# Altium schematic sheet power.SchDoc
size A3
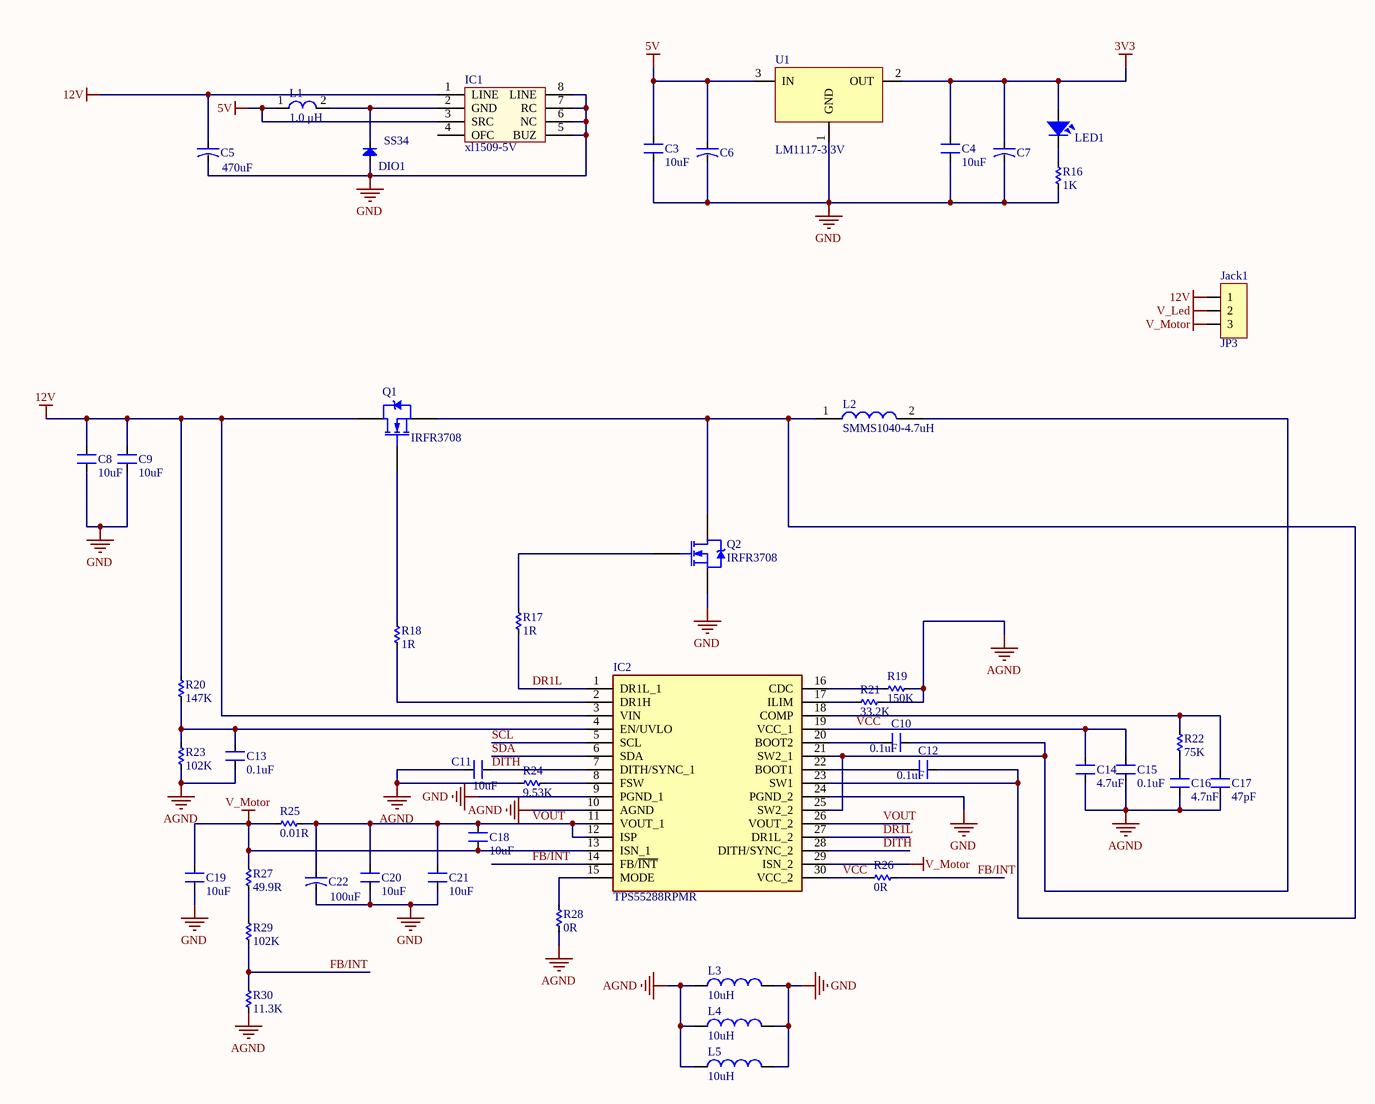
[diagram p0: power.SchDoc]

## Parts
C3  10uF  [CN-SMD-0603]
C4  10uF  [CN-SMD-0603]
C5  470uF  [CAP-ALU-SMD-6.3x7.7x2.2]
C6  CN-ALU-SMD  [CAP-ALU-SMD-4.5x5x1.4]  (value not drawn)
C7  CN-ALU-SMD  [CAP-ALU-SMD-4.5x5x1.4]  (value not drawn)
C8  10uF  [CN-SMD-1206]
C9  10uF  [CN-SMD-1206]
C10  0.1uF  [CN-SMD-0603]
C11  10uF  [CN-SMD-0603]
C12  0.1uF  [CN-SMD-0603]
C13  0.1uF  [CN-SMD-0603]
C14  4.7uF  [CN-SMD-0603]
C15  0.1uF  [CN-SMD-0603]
C16  4.7nF  [CN-SMD-0603]
C17  47pF  [CN-SMD-0603]
C18  10uF  [CN-SMD-0603]
C19  10uF  [CN-SMD-0603]
C20  10uF  [CN-SMD-0603]
C21  10uF  [CN-SMD-0603]
C22  100uF  [CAP-ALU-SMD-6.3x7.7x2.2]
DIO1  SS34  [DIO-SMD-106]
IC1  xl1509-5V  [SO-8]
IC2  TPS55288RPMR  [TPS55288RPMR]
Jack1  JP3  [JP3-D1T]
L1  1.0 μH  [L-SMD-M-7.3x4.5]
L2  SMMS1040-4.7uH  [INDPM115100X400N]
L3  10uH  [INDC1608X95N]
L4  10uH  [INDC1608X95N]
L5  10uH  [INDC1608X95N]
LED1  LED  [LED-0805-Blue]  (value not drawn)
Q1  IRFR3708  [TO-252AA_N]
Q2  IRFR3708  [TO-252AA_N]
R16  1K  [RES-SMD-0603]
R17  1R  [RES-SMD-0603]
R18  1R  [RES-SMD-0603]
R19  150K  [RES-SMD-0603]
R20  147K  [RES-SMD-0603]
R21  33.2K  [RES-SMD-0603]
R22  75K  [RES-SMD-0603]
R23  102K  [RES-SMD-0603]
R24  9.53K  [RES-SMD-0603]
R25  0.01R  [RES-SMD-1206]
R26  0R  [RES-SMD-0603]
R27  49.9R  [RES-SMD-0603]
R28  0R  [RES-SMD-0603]
R29  102K  [RES-SMD-0603]
R30  11.3K  [RES-SMD-0603]
U1  LM1117-3.3V  [SOT223]

## Nets
3V3: C4.1 C7.1 LED1.1 U1.2(OUT)
5V: C3.1 C6.1 IC1.3(SRC) L1.1 U1.3(IN)
12V: C5.1 C8.2 C9.2 IC1.1(LINE) IC2.3(VIN) Jack1.1 Q1.4(D) R20.1
AGND: C11.2 C13.1 C14.1 C15.1 C16.2 C17.2 IC2.10(AGND) L3.1 L4.1 L5.1 R19.2 R21.2 R23.2 R24.1 R28.2 R30.2
GND: C3.2 C4.2 C5.2 C6.2 C7.2 C8.1 C9.1 C19.1 C20.1 C21.1 C22.2 DIO1.1(A) IC1.5(BUZ) IC1.6(NC) IC1.7(RC) IC1.8(LINE) IC2.9(PGND_1) IC2.24(PGND_2) L3.2 L4.2 L5.2 Q2.3(S) R16.2 U1.1(GND)
V_Led: Jack1.2
V_Motor: C18.1 C19.2 IC2.13(ISN_1) IC2.29(ISN_2) Jack1.3 R25.2 R27.1
DITH: C11.1 IC2.7(DITH/SYNC_1) IC2.28(DITH/SYNC_2)
DR1L: IC2.1(DR1L_1) IC2.27(DR1L_2) R17.2
FB/INT: IC2.14(FB/~{INT}) R26.2 R29.2 R30.1
SCL: IC2.5(SCL)
SDA: IC2.6(SDA)
VCC: C14.2 C15.2 IC2.19(VCC_1) IC2.30(VCC_2) R26.1
VOUT: C18.2 C20.2 C21.2 C22.1 IC2.11(VOUT_1) IC2.12(ISP) IC2.26(VOUT_2) R25.1
NetC10_1: C10.1 IC2.21(SW2_1) IC2.25(SW2_2) L2.2
NetC10_2: C10.2 IC2.20(BOOT2)
NetC12_1: C12.1 IC2.23(SW1) L2.1 Q1.3(S) Q2.4(D)
NetC12_2: C12.2 IC2.22(BOOT1)
NetC13_2: C13.2 IC2.4(EN/UVLO) R20.2 R23.1
NetC16_1: C16.1 R22.2
NetC17_1: C17.1 IC2.18(COMP) R22.1
NetDIO1_2: DIO1.2(K) IC1.2(GND) L1.2
NetIC2_2: IC2.2(DR1H) R18.2
NetIC2_8: IC2.8(FSW) R24.2
NetIC2_15: IC2.15(MODE) R28.1
NetIC2_16: IC2.16(CDC) R19.1
NetIC2_17: IC2.17(ILIM) R21.1
NetLED1_2: LED1.2 R16.1
NetQ1_1: Q1.1(G) R18.1
NetQ2_1: Q2.1(G) R17.1
NetR27_2: R27.2 R29.1

Not connected (* = marked no-connect by the designer): IC1 4(OFC)

## Library data of the parts
C3 C4 C8-C12 C14-C21 = CN: Tu gom; Value: 33pF
C5-C7 C22 = CN-ALU-SMD: Polarized Capacitor (Axial); Published: 8-Jun-2000; LatestRevisionDate: 17-Jul-2002; LatestRevisionNote: Re-released for DXP Platform.; PackageReference: POLAR0.8; Publisher: Altium Limited
C13 = CN: Value: 33pF
DIO1 = Diode SMD: Default Diode; Code - JEDEC: DO-214-AB; Value: 1N5007; Published: 8-Jun-2000; Revision: July-2002: Re-released for DXP Platform.; Publisher: Altium Limited
IC1 = LS1240A: Electronic Two-Tone Ringer
IC2 = TPS55288RPMR: Integrated Circuit; Manufacturer_Name: Texas Instruments; Datasheet Link: https://www.ti.com/lit/ds/symlink/tps55288.pdf; Height: 1mm; Manufacturer_Part_Number: TPS55288RPMR; Mouser Part Number: 595-TPS55288RPMR; Mouser Price/Stock: https://www.mouser.co.uk/ProductDetail/Texas-Instruments/TPS55288RPMR?qs=bAKSY%2FctAC57bSsN8PUBnQ%3D%3D; Arrow Part Number: TPS55288RPMR; Arrow Price/Stock: https://www.arrow.com/en/products/tps55288rpmr/texas-instruments?region=nac
Jack1 = JP3: WR-PHD 2.54 mm Angled Socket Header; Manufacturer: W¨¹rth Elektronik eiSos GmbH; partNo: 613003143121; ComponentLink1 Description: Manufacturer; ComponentLink2 Description: Datasheet; NoPins: 03; Created Date: 29 March 2013; ComponentLink1URL: http://www.we-online.com; ComponentLink2URL: http://katalog.we-online.de/em/datasheet/6130xx143121.pdf; Created by: Karrer Zheng
L1 = L-SMD-1: partNo: 78477010; Manufacturer: Wurth Elektronik; Inductance: 1.0 μH; ComponentLink1Description: Manufacturer; ComponentLink1URL: http://www.we-online.de; Created by: Baojun Chen; Created Date: Nov.2015; ComponentLink2Description: Datasheet; ComponentLink2URL: http://katalog.we-online.de/pbs/datasheet/78477010.pdf
L2 = SMMS1040-220M: Inductor; Manufacturer_Name: Shun Xiang Nuo Elec; Datasheet Link: https://datasheet.lcsc.com/szlcsc/ShunXiang-Connaught-Elec-SMMS1040-220M_C149597.pdf; Height: 4mm; Manufacturer_Part_Number: SMMS1040-220M
L3-L5 = ASMCI-0603-100N-T: Ind Chip Shielded Multi-Layer 10uH 30% 1MHz Ferrite 50mA 0603 T/R; Package: None; Price: None; Value: *; MP: ASMCI-0603-100N-T; Availability: Unavailable
LED1 = LED SMD: Value: LED 3 - 5 ly 2 Colour
Q1 Q2 = IRFR3910: HEXFET Power MOSFET; Note: Pin 2 is trimmed and is electrically connected to Drain.; Published: 8-Jun-2000; LatestRevisionDate: 20-Nov-2009; LatestRevisionNote: IPC-7351 Footprint Added.; DatasheetVersion: May-1998; PackageVersion: Feb-2003; PackageReference: TO-252AA; Publisher: Altium Limited; PackageDescription: 3-Pin HEXFET Package 2.28 mm Pitch, 9.9 mm Lead Span; Code_JEDEC: TO-252-AA; ComponentLink1Description: Manufacturer Link; ComponentLink1URL: http://www.irf.com/; ComponentLink2Description: Datasheet; ComponentLink2URL: http://www.irf.com/product-info/datasheets/data/irfr3910.pdf
R16-R30 = Res-SMD: Resistor; Manufacturer: Generic Components; Class: Passive; Published: 08/06/2000; Publisher: Altium Hobart Technology Centre
U1 = LM1117: 800mA Low-Dropout Linear Regulator; Creator: Nguyen Ba Bien; Website: http://group3i.net